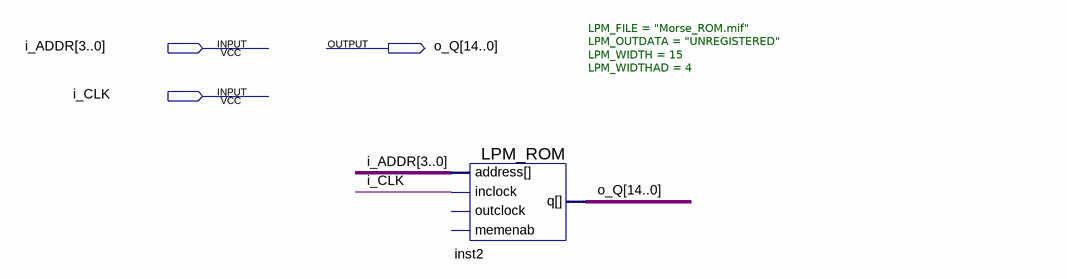
[diagram p0: schematic sheet]
// Quartus schematic Morse_ROM.bdf as structural Verilog: 1 symbols, 3 pins
module Morse_ROM (
  input  [3:0] i_ADDR,
  input  i_CLK,
  output [14:0] o_Q
);

  LPM_ROM #(.LPM_FILE("Morse_ROM.mif"), .LPM_OUTDATA("UNREGISTERED"), .LPM_WIDTH(15), .LPM_WIDTHAD(4)) inst2 (
    .address(i_ADDR), .inclock(i_CLK), .q(o_Q));  // open: outclock, memenab
endmodule
